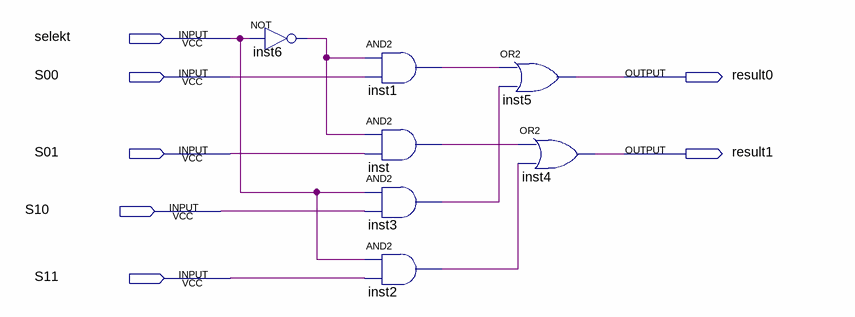
[diagram p0: schematic sheet]
// Quartus schematic zweibitmultiplexer.bdf as structural Verilog: 7 symbols, 7 pins
module zweibitmultiplexer (
  input  selekt,
  input  S00,
  input  S01,
  input  S10,
  input  S11,
  output result0,
  output result1
);

  wire inst1_out, inst2_out, inst3_out, inst6_out, inst_out;

  not inst6 (inst6_out, selekt);
  and inst1 (inst1_out, inst6_out, S00);
  and inst (inst_out, inst6_out, S01);
  and inst3 (inst3_out, selekt, S10);
  and inst2 (inst2_out, selekt, S11);
  or inst5 (result0, inst1_out, inst3_out);
  or inst4 (result1, inst_out, inst2_out);
endmodule
